# EAGLE design Pico_26Pin_Keyboard (EAGLE 9.6.2)
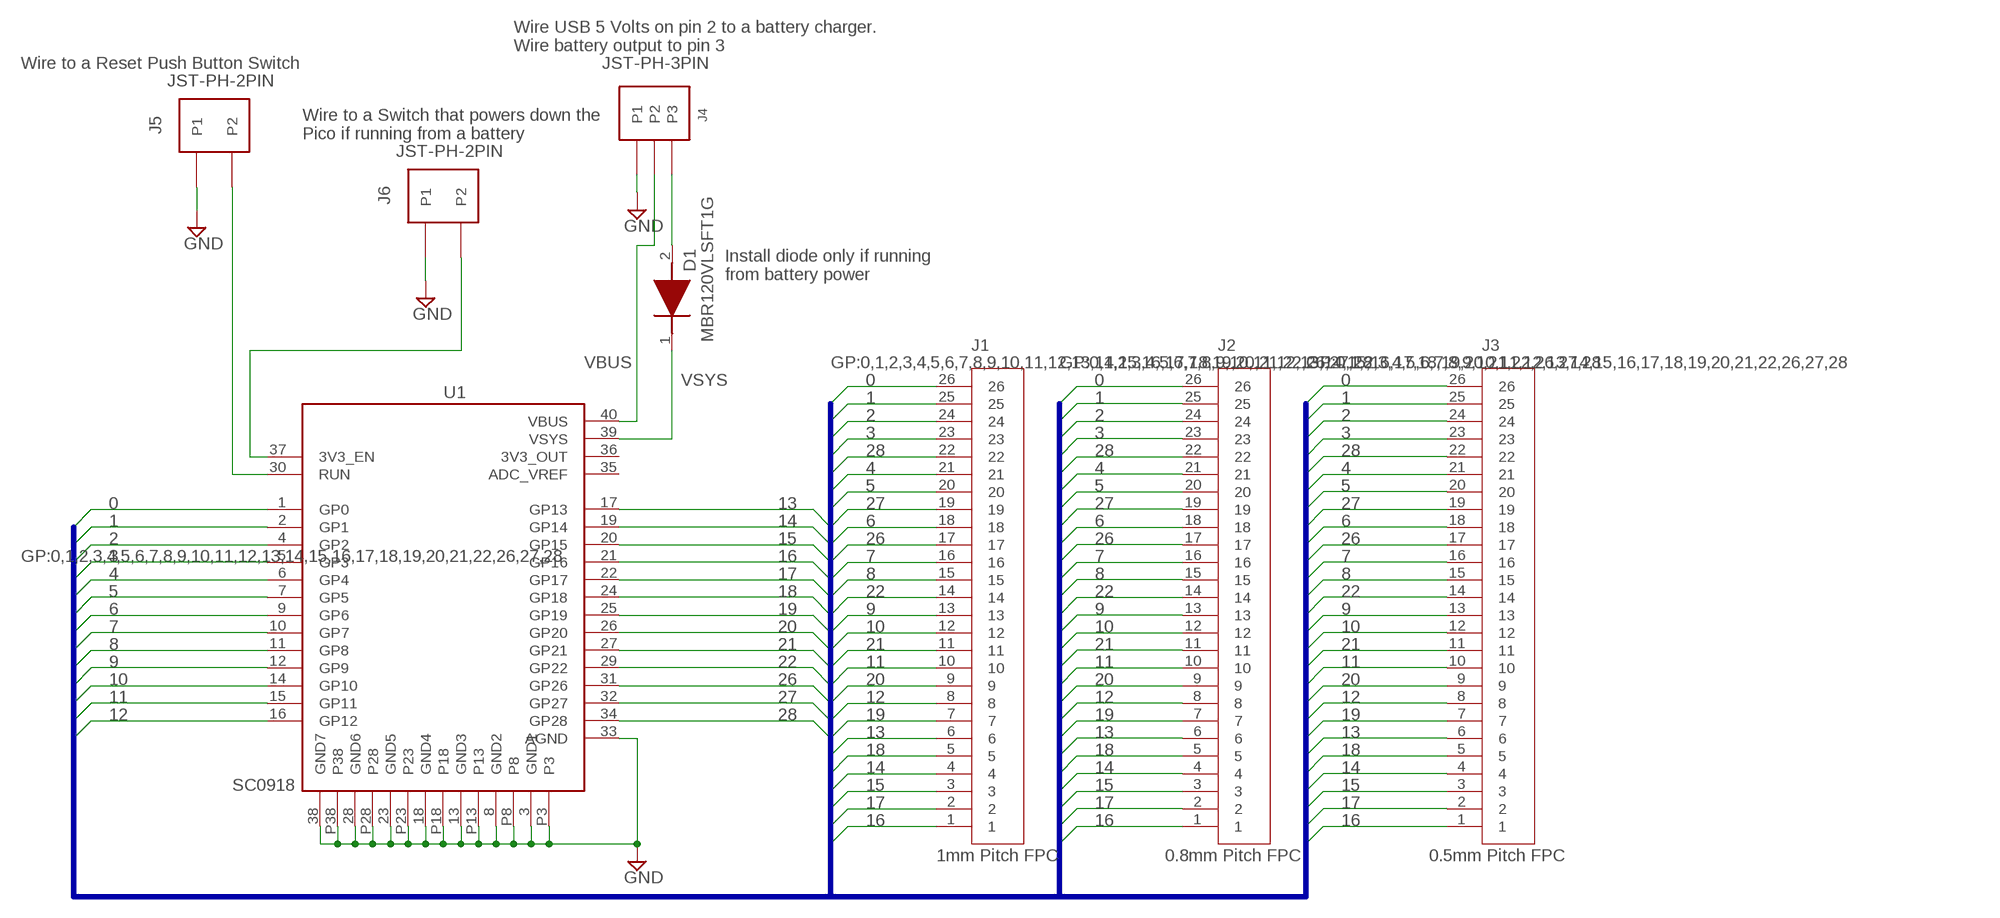
[diagram p0: schematic, sheet 1]

## Parts
D1  MBR120VLSFT1G  [SODFL3616X98N]
J1  1mm Pitch FPC  FPC26  [FPC26]
J2  0.8mm Pitch FPC  FPC26_P8MM  [FPC26_P8MM]
J3  0.5mm Pitch FPC  FPC26_P5MM  [FPC26_P5MM]
J4  JST-PH-3PIN  [JST-PH-3PIN]
J5  JST-PH-2PIN  [JST-PH-2PIN]
J6  JST-PH-2PIN  [JST-PH-2PIN]
U1  SC0918  [MODULE_SC0918]

## Nets
0: J1.26 J2.26 J3.26 U1.1(GP0)
1: J1.25 J2.25 J3.25 U1.2(GP1)
2: J1.24 J2.24 J3.24 U1.4(GP2)
3: J1.23 J2.23 J3.23 U1.5(GP3)
4: J1.21 J2.21 J3.21 U1.6(GP4)
5: J1.20 J2.20 J3.20 U1.7(GP5)
6: J1.18 J2.18 J3.18 U1.9(GP6)
7: J1.16 J2.16 J3.16 U1.10(GP7)
8: J1.15 J2.15 J3.15 U1.11(GP8)
9: J1.13 J2.13 J3.13 U1.12(GP9)
10: J1.12 J2.12 J3.12 U1.14(GP10)
11: J1.10 J2.10 J3.10 U1.15(GP11)
12: J1.8 J2.8 J3.8 U1.16(GP12)
13: J1.6 J2.6 J3.6 U1.17(GP13)
14: J1.4 J2.4 J3.4 U1.19(GP14)
15: J1.3 J2.3 J3.3 U1.20(GP15)
16: J1.1 J2.1 J3.1 U1.21(GP16)
17: J1.2 J2.2 J3.2 U1.22(GP17)
18: J1.5 J2.5 J3.5 U1.24(GP18)
19: J1.7 J2.7 J3.7 U1.25(GP19)
20: J1.9 J2.9 J3.9 U1.26(GP20)
21: J1.11 J2.11 J3.11 U1.27(GP21)
22: J1.14 J2.14 J3.14 U1.29(GP22)
26: J1.17 J2.17 J3.17 U1.31(GP26)
27: J1.19 J2.19 J3.19 U1.32(GP27)
28: J1.22 J2.22 J3.22 U1.34(GP28)
GND: J4.P$1(P1) J5.P$1(P1) J6.P$1(P1) U1.3(GND1) U1.8(GND2) U1.13(GND3) U1.18(GND4) U1.23(GND5) U1.28(GND6) U1.33(AGND) U1.38(GND7) U1.P3 U1.P8 U1.P13 U1.P18 U1.P23 U1.P28 U1.P38
N$1: J5.P$2(P2) U1.30(RUN)
N$2: J6.P$2(P2) U1.37(3V3_EN)
VBAT: D1.2(A) J4.P$3(P3)
VBUS: J4.P$2(P2) U1.40(VBUS)
VSYS: D1.1(K) U1.39(VSYS)

## Buses
GP:0,1,2,3,4,5,6,7,8,9,10,11,12,13,14,15,16,17,18,19,20,21,22,26,27,28

## Notes on the sheet
- Wire USB 5 Volts on pin 2 to a battery charger.
  Wire battery output to pin 3
- Wire to a Reset Push Button Switch
- Wire to a Switch that powers down the
  Pico if running from a battery
- Install diode only if running 
  from battery power

## Power pins joined to a net without a drawn wire
3V3_OUT: U1.36(3V3_OUT)
ADC_VREF: U1.35(ADC_VREF)

## Library data of the parts
D1 = SamacSys_Parts:MBR120VLSFT1G: Diode Schottky 20V 1A SOD123FL ON Semi MBR120VLSFT1G, SMT Schottky Diode, 20V 1A, 2-Pin SOD-123FL Source: Datasheet <http://www.onsemi.com/pub/Collateral/MBR120VLSFT1-D.PDF>; DESCRIPTION: Diode Schottky 20V 1A SOD123FL ON Semi MBR120VLSFT1G, SMT Schottky Diode, 20V 1A, 2-Pin SOD-123FL; HEIGHT: 0.98mm; MANUFACTURER_NAME: onsemi; MANUFACTURER_PART_NUMBER: MBR120VLSFT1G; MOUSER_PART_NUMBER: 863-MBR120VLSFT1G; MOUSER_PRICE-STOCK: https://www.mouser.co.uk/ProductDetail/onsemi/MBR120VLSFT1G?qs=3JMERSakebpX%252BkItPpFCkg%3D%3D
J1 = FPC26:FPC26: Molex Right Angle FPC Connector 1mm pitch, bottom contacts with 32 pins. Molex Part Number DigiKey Part Number
J2 = FPC26_p8mm:FPC26_P8MM: Molex Right Angle FPC Connector 1mm pitch, bottom contacts with 32 pins. Molex Part Number DigiKey Part Number
J3 = FPC26_p5mm:FPC26_P5MM: Molex Right Angle FPC Connector 1mm pitch, bottom contacts with 32 pins. Molex Part Number DigiKey Part Number
J4 = JST-PH-3PIN:JST-PH-3PIN
J5 J6 = JST-PH-2PIN:JST-PH-2PIN
U1 = SC0918:SC0918: Check availability <https://pricing.snapeda.com/parts/SC0918/Raspberry%20Pi/view-part?ref=eda>; AVAILABILITY: In Stock; CHECK_PRICES: https://www.snapeda.com/parts/SC0918/Raspberry+Pi/view-part/?ref=eda; DESCRIPTION: - RP2040 Transceiver; 802.11 b/g/n (Wi-Fi, WiFi, WLAN), Bluetooth® 5.x 2.4GHz Evaluation Board; MF: Raspberry Pi; MP: SC0918; PACKAGE: None; PRICE: None; SNAPEDA_LINK: https://www.snapeda.com/parts/SC0918/Raspberry+Pi/view-part/?ref=snap

## Board
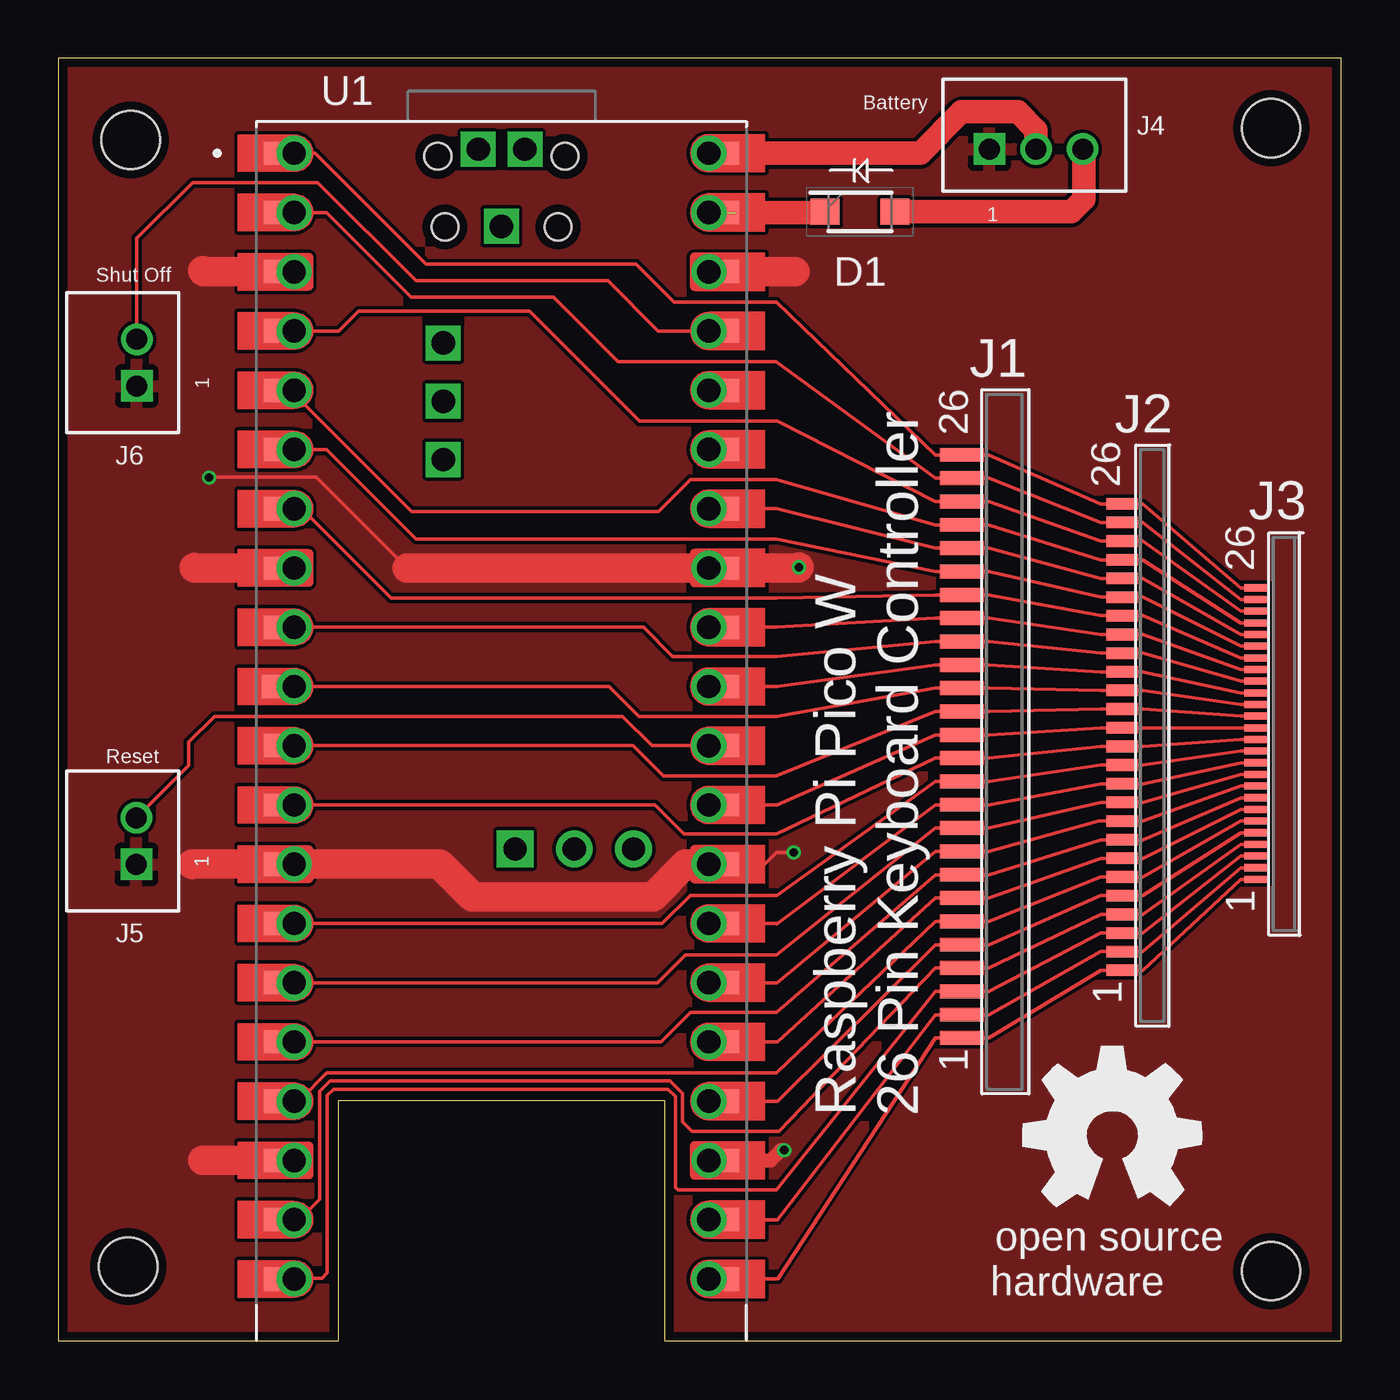
[diagram p1: board, top side]
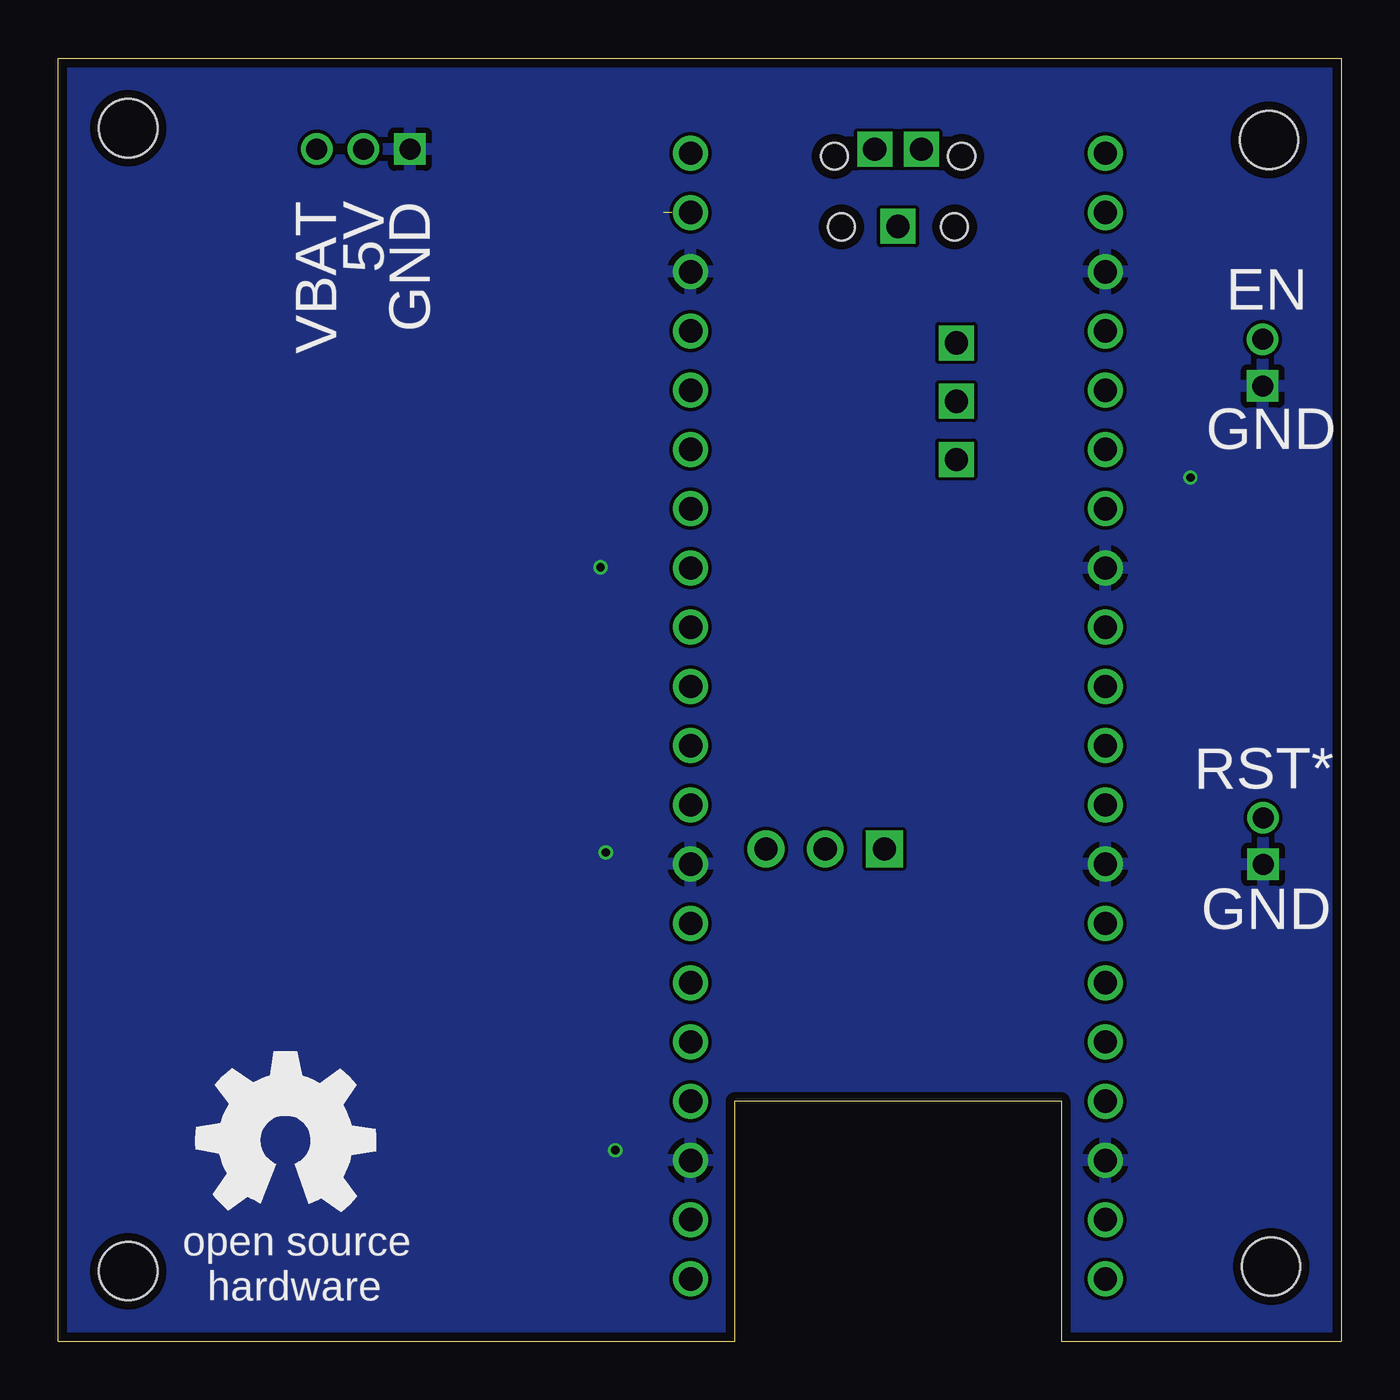
[diagram p2: board, bottom side, seen from below]

Size 55 x 55 mm. Coordinates in mm from the lower left corner, seen from the top.
Outline: 55,0 55,55 0,55 0,0 12,0 12,10.3 26,10.3 26,0 55,0
Copper layers (1*16): Top 0.035559375mm / dielectric 1.6mm / Bottom 0.035559375mm
Design rules "oshpark-2layer": minimum track width 6mil, minimum drill 10mil, track to track 6mil, track to pad 6mil, pad to pad 6mil, via to via 6mil, smd to smd 6mil, copper to edge 15mil, drill to drill 6mil, minimum pad ring 5mil, minimum via ring 5mil, stop-mask expansion 2.5mil, vias tented up to drill 0mil, thermal gap 10mil
Holes 2.5 mm at 52,52 52,3 3,3.2 3.1,51.5

### Footprints (pad centres in the part's own frame; a part is rotated, then mirrored left to right if it is on the bottom)
SODFL3616X98N = smd 1.24 x 1.12: 1 -1.5,0; 2 1.5,0
FPC26 = smd 0.6 x 1.9: 1 -13.7,3.86; 2 -12.7,3.86; 3 -11.7,3.86; 4 -10.7,3.86; 5 -9.7,3.86; 6 -8.7,3.86; 7 -7.7,3.86; 8 -6.7,3.86; 9 -5.7,3.86; 10 -4.7,3.86; 11 -3.7,3.86; 12 -2.7,3.86; 13 -1.7,3.86; 14 -0.7,3.86; 15 0.3,3.86; 16 1.3,3.86; 17 2.3,3.86; 18 3.3,3.86; 19 4.3,3.86; 20 5.3,3.86; 21 6.3,3.86; 22 7.3,3.86; 23 8.3,3.86; 24 9.3,3.86; 25 10.3,3.86; 26 11.3,3.86
FPC26_P8MM = smd 0.5 x 1.35: 1 -13.7,3.6; 2 -12.9,3.6; 3 -12.1,3.6; 4 -11.3,3.6; 5 -10.5,3.6; 6 -9.7,3.6; 7 -8.9,3.6; 8 -8.1,3.6; 9 -7.3,3.6; 10 -6.5,3.6; 11 -5.7,3.6; 12 -4.9,3.6; 13 -4.1,3.6; 14 -3.3,3.6; 15 -2.5,3.6; 16 -1.7,3.6; 17 -0.9,3.6; 18 -0.1,3.6; 19 0.7,3.6; 20 1.5,3.6; 21 2.3,3.6; 22 3.1,3.6; 23 3.9,3.6; 24 4.7,3.6; 25 5.5,3.6; 26 6.3,3.6
FPC26_P5MM = smd 0.3 x 1.1: 1 -13.7,3.5; 2 -13.2,3.5; 3 -12.7,3.5; 4 -12.2,3.5; 5 -11.7,3.5; 6 -11.2,3.5; 7 -10.7,3.5; 8 -10.2,3.5; 9 -9.7,3.5; 10 -9.2,3.5; 11 -8.7,3.5; 12 -8.2,3.5; 13 -7.7,3.5; 14 -7.2,3.5; 15 -6.7,3.5; 16 -6.2,3.5; 17 -5.7,3.5; 18 -5.2,3.5; 19 -4.7,3.5; 20 -4.2,3.5; 21 -3.7,3.5; 22 -3.2,3.5; 23 -2.7,3.5; 24 -2.2,3.5; 25 -1.7,3.5; 26 -1.2,3.5
JST-PH-3PIN = drill 0.9 square: P$1 -2.98,0.01 | drill 0.9: P$2 -0.98,0.01; P$3 1.02,0.01
JST-PH-2PIN = drill 0.9 square: P$1 -1,0 | drill 0.9: P$2 1,0
MODULE_SC0918 = smd 1 x 1: 1 -9.69,24.13; 2 -9.69,21.59; 3 -9.69,19.05; 4 -9.69,16.51; 5 -9.69,13.97; 6 -9.69,11.43; 7 -9.69,8.89; 8 -9.69,6.35; 9 -9.69,3.81; 10 -9.79,1.27; 11 -9.69,-1.27; 12 -9.69,-3.81; 13 -9.69,-6.35; 14 -9.69,-8.89; 15 -9.69,-11.43; 16 -9.69,-13.97; 17 -9.69,-16.51; 18 -9.69,-19.05; 19 -9.69,-21.59; 20 -9.69,-24.13; 21 9.69,-24.13; 22 9.69,-21.59; 23 9.69,-19.05; 24 9.69,-16.51; 25 9.69,-13.97; 26 9.69,-11.43; 27 9.69,-8.89; 28 9.69,-6.35; 29 9.69,-3.81; 30 9.69,-1.27; 31 9.69,1.27; 32 9.69,3.81; 33 9.69,6.35; 34 9.69,8.89; 35 9.69,11.43; 36 9.69,13.97; 37 9.69,16.51; 38 9.69,19.05; 39 9.69,21.59; 40 9.69,24.13 | drill 1 pad 1.575 square: E 0.584,-5.7 | drill 1 pad 1.575: F 3.124,-5.7; G 5.664,-5.7 | drill 1: P1 -8.89,24.13; P2 -8.89,21.59; P3 -8.89,19.05; P4 -8.89,16.51; P5 -8.89,13.97; P6 -8.89,11.43; P7 -8.89,8.89; P8 -8.89,6.35; P9 -8.89,3.81; P10 -8.89,1.27; P11 -8.89,-1.27; P12 -8.89,-3.81; P13 -8.89,-6.35; P14 -8.89,-8.89; P15 -8.89,-11.43; P16 -8.89,-13.97; P17 -8.89,-16.51; P18 -8.89,-19.05; P19 -8.89,-21.59; P20 -8.89,-24.13; P21 8.89,-24.13; P22 8.89,-21.59; P23 8.89,-19.05; P24 8.89,-16.51; P25 8.89,-13.97; P26 8.89,-11.43; P27 8.89,-8.89; P28 8.89,-6.35; P29 8.89,-3.81; P30 8.89,-1.27; P31 8.89,1.27; P32 8.89,3.81; P33 8.89,6.35; P34 8.89,8.89; P35 8.89,11.43; P36 8.89,13.97; P37 8.89,16.51; P38 8.89,19.05; P39 8.89,21.59; P40 8.89,24.13 | drill 1 pad 1.5 square: TP1 0,21; TP2 1,24.3; TP3 -1,24.3; TP4 -2.5,16; TP5 -2.5,13.5; TP6 -2.5,11 | hole 1.15: -2.425,20.97; 2.425,20.97; -2.725,24; 2.725,24

### Placement (x,y rotation side)
D1  34.37,48.42 0 top
J1  42.6,26.7 90 top
J2  49.2,29.6 90 top
J3  54.9,33.5 90 top
J4  42.9,51.1 0 top
J5  3.35,21.44 90 top
J6  3.37,41.95 90 top
U1  19,26.8 0 top
U$1  [OSHW_8MM]  45.16,8.81 0 top
U$2  [OSHW_8MM]  45.23,8.6 0 top

### Tracks (layer width: path | path; a pad name or v marks a point on that pad's centre or on a via)
0
  Top 0.152: J3.26 50.7,32.3 46.5,35.9 J2.26 44.7,35.9 39.9,38 J1.26 37.6,38 30.78,44.55 26.39,44.55 24.77,46.17 15.77,46.17 11.01,50.93 U1.1
1
  Top 0.152: J3.25 50.7,31.8 46.5,35.1 J2.25 44.7,35.1 39.9,37 J1.25 37.6,37 30.76,42 23.99,42 21.23,44.76 15.13,44.76 11.5,48.39 U1.2
2
  Top 0.152: J3.24 50.7,31.3 46.5,34.3 J2.24 44.7,34.3 39.9,36 J1.24 37.6,36 30.83,39.44 24.92,39.44 20.2,44.16 12.87,44.16 12.02,43.31 U1.4
3
  Top 0.152: J3.23 50.7,30.8 46.5,33.5 J2.23 44.7,33.5 39.9,35 J1.23 37.6,35 30.8,36.93 27.1,36.93 25.74,35.57 15.15,35.57 9.95,40.77 U1.5
4
  Top 0.152: J3.21 50.7,29.8 46.5,31.9 J2.21 44.7,31.9 39.9,33 J1.21 37.6,33 30.78,34.39 15.34,34.39 11.5,38.23 U1.6
5
  Top 0.152: J3.20 50.7,29.3 46.5,31.1 J2.20 44.7,31.1 39.9,32 J1.20 37.6,32 30.8,31.86 14.27,31.86 10.44,35.69 U1.7
6
  Top 0.152: J3.18 50.7,28.3 46.5,29.5 J2.18 44.7,29.5 39.9,30 J1.18 37.6,30 30.8,29.36 26.33,29.36 25.08,30.61 U1.9
7
  Top 0.152: J3.16 50.7,27.3 46.5,27.9 J2.16 44.7,27.9 39.9,28 J1.16 37.6,28 30.8,26.79 24.89,26.79 23.61,28.07 U1.10
8
  Top 0.152: J3.15 50.7,26.8 46.5,27.1 J2.15 44.7,27.1 39.9,27 J1.15 37.6,27 30.76,24.23 25.95,24.23 24.65,25.53 U1.11
9
  Top 0.152: J3.13 50.7,25.8 46.5,25.5 J2.13 44.7,25.5 39.9,25 J1.13 37.6,25 30.78,21.74 26.83,21.74 25.58,22.99 U1.12
10
  Top 0.152: J3.12 50.7,25.3 46.5,24.7 J2.12 44.7,24.7 39.9,24 J1.12 37.6,24 30.82,19.12 27.1,19.12 25.89,17.91 U1.14
11
  Top 0.152: J3.10 50.7,24.3 46.5,23.1 J2.10 44.7,23.1 39.9,22 J1.10 37.6,22 30.8,16.57 26.89,16.57 25.69,15.37 U1.15
12
  Top 0.152: J3.8 50.7,23.3 46.5,21.5 J2.8 44.7,21.5 39.9,20 J1.8 37.6,20 30.78,14.09 27.1,14.09 25.84,12.83 U1.16
13
  Top 0.152: J3.6 50.7,22.3 46.5,19.9 J2.6 44.7,19.9 39.9,18 J1.6 37.6,18 30.8,11.5 11.5,11.5 10.4,10.4 9.42,10.4 U1.17
14
  Top 0.152: J3.4 50.7,21.3 46.5,18.3 J2.4 44.7,18.3 39.9,16 J1.4 37.6,16 30.9,9 27.16,9 26.76,9.4 26.76,10.62 26.22,11.15 11.65,11.15 11.2,10.7 11.2,6.09 10.32,5.21 U1.19
15
  Top 0.152: J3.3 50.7,20.8 46.5,17.5 J2.3 44.7,17.5 39.9,15 J1.3 37.6,15 30.8,6.5 26.56,6.5 26.46,6.6 26.46,10.49 26.15,10.8 11.8,10.8 11.53,10.53 11.53,2.93 11.3,2.7 9.34,2.7 U1.20
16
  Top 0.152: J3.1 50.7,19.8 46.5,15.9 J2.1 44.7,15.9 39.9,13 J1.1 37.6,13 30.85,2.67 U1.21
17
  Top 0.152: J3.2 50.7,20.3 46.5,16.7 J2.2 44.7,16.7 39.9,14 J1.2 37.6,14 30.83,5.21 U1.22
18
  Top 0.152: J3.5 50.7,21.8 46.5,19.1 J2.5 44.7,19.1 39.9,17 J1.5 37.6,17 30.83,10.29 U1.24
19
  Top 0.152: J3.7 50.7,22.8 46.5,20.7 J2.7 44.7,20.7 39.9,19 J1.7 37.6,19 30.83,12.83 U1.25
20
  Top 0.152: J3.9 50.7,23.8 46.5,22.3 J2.9 44.6,22.3 39.9,21 J1.9 37.6,21 30.81,15.37 U1.26
21
  Top 0.152: J3.11 50.7,24.8 46.5,23.9 J2.11 44.7,23.9 39.9,23 J1.11 37.6,23 30.82,17.9 30.82,17.91 U1.27
22
  Top 0.152: J3.14 J2.14 44.7,26.3 39.9,26 J1.14 37.6,26 30.82,22.99 U1.29
26
  Top 0.152: J3.17 50.7,27.8 46.5,28.7 J2.17 44.7,28.7 39.9,29 J1.17 37.6,29 30.82,28.07 U1.31
27
  Top 0.152: J3.19 50.7,28.8 46.5,30.3 J2.19 44.7,30.3 39.9,31 J1.19 37.6,31 30.8,30.61 U1.32
28
  Top 0.152: J3.22 50.7,30.3 46.5,32.7 J2.22 44.7,32.7 39.9,34 J1.22 37.6,34 30.8,35.69 U1.34
GND  (via drill 0.35)
  Top 0.152: 9.38,45.85 U1.3 | U1.P28 28.64,20.45 U1.28 30.29,20.45 30.8,20.96 v31.53,20.96 | v6.46,37.02 6.46,37.04 11.06,37.04 14.95,33.15
  Top 0.61: U1.23 30.54,7.75 30.98,8.19 v31.12,8.19
  Top 1.27: 28.64,20.45 26.9,20.45 25.5,19.05 17.75,19.05 16.35,20.45 U1.P13 U1.13 5.74,20.45 5.73,20.44 | U1.P23 U1.23 | U1.P18 U1.18 6.2,7.75 6.19,7.76 | U1.P8 U1.8 5.84,33.15 5.83,33.16 | U1.P3 9.38,45.85 | U1.3 6.23,45.85 6.19,45.89 | U1.P38 U1.38 31.58,45.85 | v31.75,33.18 31.72,33.15 U1.33 14.95,33.15
  pour Top: 0,-0.1 0,54.9 55,54.9 55,-0.1 26,-0.1 26,10.2 12,10.2 12,-0.1
  pour Bottom: -0.1,-0.1 -0.1,54.9 55.1,54.9 55.1,-0.1 26,-0.1 26,10.2 12,10.2 12,-0.1
N$1
  Top 0.152: J5.P$2 5.6,24.69 5.6,25.69 6.7,26.79 24.19,26.79 25.45,25.53 U1.30
N$2
  Top 0.152: J6.P$2 3.37,47.28 5.76,49.67 11.12,49.67 15.33,45.46 23.56,45.46 25.71,43.31 26.73,43.31 U1.37
VBAT
  Top 0.508: 43.96,51.07 J4.P$3
  Top 1.016: D1.2 43.43,48.42 43.96,48.95 43.96,51.07
VBUS
  Top 1.016: U1.40 36.95,50.93 38.72,52.7 41.14,52.7 41.92,51.92 J4.P$2
VSYS  (1 unrouted)
  Top 0.508: 29.08,48.42 29.05,48.39 | 32.84,48.39 D1.1
  Top 1.016: U1.39 32.84,48.39

### Text on the board
tPlace: Battery | Shut Off | Reset | Raspberry Pi Pico W / 26 Pin Keyboard Controller
bPlace: GND | 5V | VBAT | EN | GND | RST* | GND